# Altium schematic sheet pico_host_board_top.SchDoc
size B; SheetNumber: 1; SheetTotal: 2
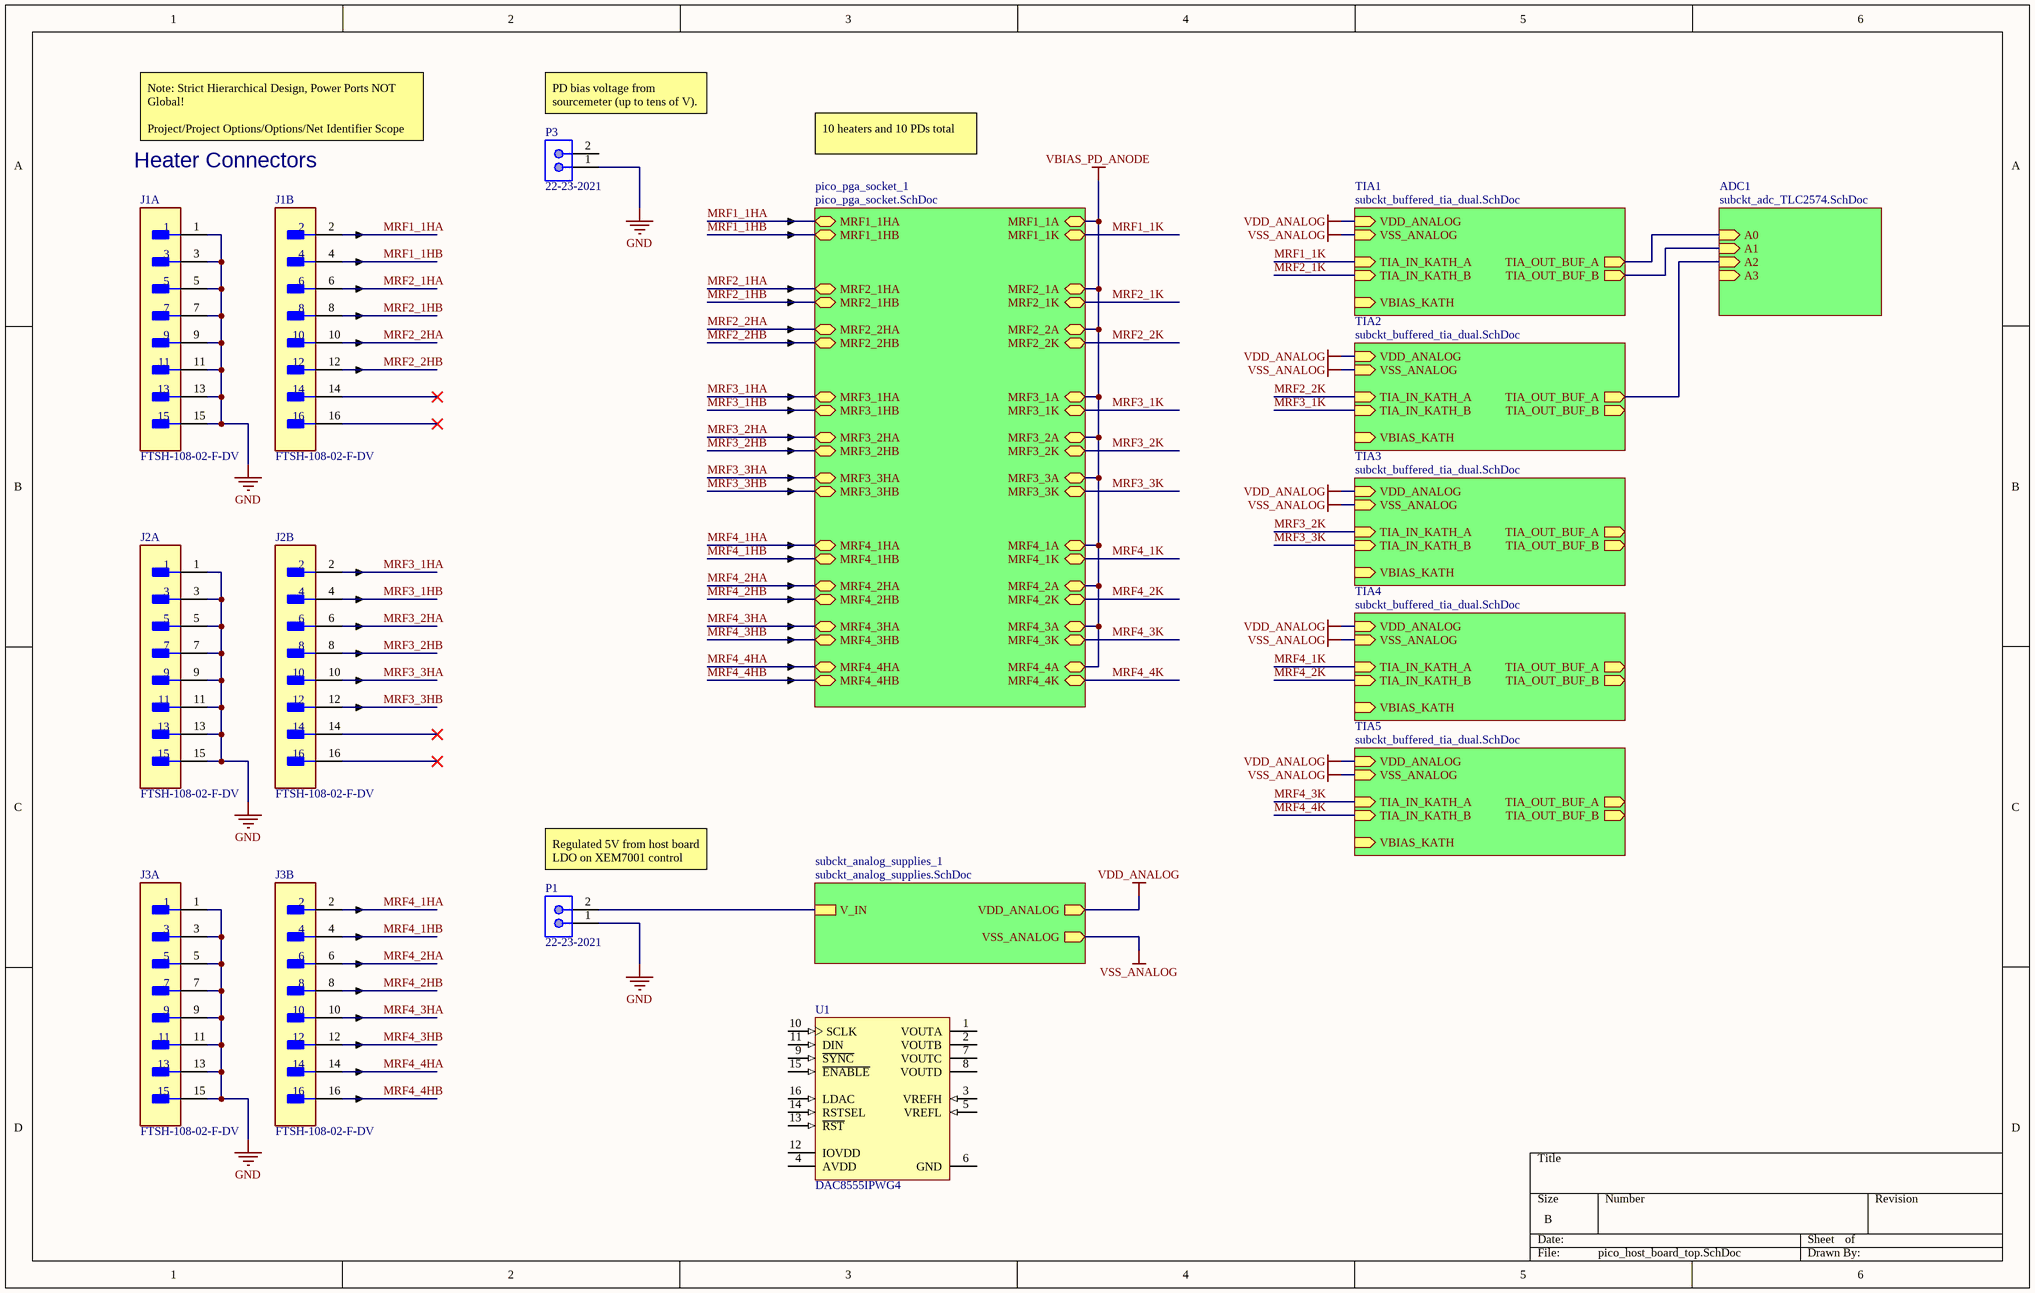
[diagram p0: pico_host_board_top.SchDoc]

## Parts
J1  FTSH-108-02-F-DV  [LIBRARYSOURCE=Vault|VAULTGUID=B7D15EC3-160A-466F-A46C-7801FE6295A7|REVISIONGUID=4386816A-B426-492F-A73C-09950B70C106|FOOTPRINT=FP-FTSH-108-02-F-DV]  (parts A,B of 2)
J2  FTSH-108-02-F-DV  [LIBRARYSOURCE=Vault|VAULTGUID=B7D15EC3-160A-466F-A46C-7801FE6295A7|REVISIONGUID=4386816A-B426-492F-A73C-09950B70C106|FOOTPRINT=FP-FTSH-108-02-F-DV]  (parts A,B of 2)
J3  FTSH-108-02-F-DV  [LIBRARYSOURCE=Vault|VAULTGUID=B7D15EC3-160A-466F-A46C-7801FE6295A7|REVISIONGUID=4386816A-B426-492F-A73C-09950B70C106|FOOTPRINT=FP-FTSH-108-02-F-DV]  (parts A,B of 2)
P1  22-23-2021  [MOLX-22-23-2021_V]
P3  22-23-2021  [MOLX-22-23-2021_V]
U1  DAC8555IPWG4  [TI-PW16_L]

## Sub-sheets
ADC1 = subckt_adc_TLC2574.SchDoc: A0 (in), A1 (in), A2 (in), A3 (in)
pico_pga_socket_1 = pico_pga_socket.SchDoc: MRF1_1HA (bidir), MRF1_1HB (bidir), MRF2_1HA (bidir), MRF2_1HB (bidir), MRF2_2HA (bidir), MRF2_2HB (bidir), MRF3_1HA (bidir), MRF3_1HB (bidir), MRF3_2HA (bidir), MRF3_2HB (bidir), MRF3_3HA (bidir), MRF3_3HB (bidir), MRF4_1HA (bidir), MRF4_1HB (bidir), MRF4_2HA (bidir), MRF4_2HB (bidir), MRF4_3HA (bidir), MRF4_3HB (bidir), MRF4_4HA (bidir), MRF4_4HB (bidir), MRF1_1A (bidir), MRF1_1K (bidir), MRF2_1A (bidir), MRF2_1K (bidir), MRF2_2A (bidir), MRF2_2K (bidir), MRF3_1A (bidir), MRF3_1K (bidir), MRF3_2A (bidir), MRF3_2K (bidir), MRF3_3A (bidir), MRF3_3K (bidir), MRF4_1A (bidir), MRF4_1K (bidir), MRF4_2A (bidir), MRF4_2K (bidir), MRF4_3A (bidir), MRF4_3K (bidir), MRF4_4A (bidir), MRF4_4K (bidir)
subckt_analog_supplies_1 = subckt_analog_supplies.SchDoc: V_IN, VDD_ANALOG (out), VSS_ANALOG (out)
TIA1 = subckt_buffered_tia_dual.SchDoc: VDD_ANALOG (in), VSS_ANALOG (in), TIA_IN_KATH_A (in), VBIAS_KATH (in), TIA_OUT_BUF_A (out), TIA_IN_KATH_B (in), TIA_OUT_BUF_B (out)
TIA2 = subckt_buffered_tia_dual.SchDoc: VDD_ANALOG (in), VSS_ANALOG (in), TIA_IN_KATH_A (in), VBIAS_KATH (in), TIA_OUT_BUF_A (out), TIA_IN_KATH_B (in), TIA_OUT_BUF_B (out)
TIA3 = subckt_buffered_tia_dual.SchDoc: VDD_ANALOG (in), VSS_ANALOG (in), TIA_IN_KATH_A (in), VBIAS_KATH (in), TIA_OUT_BUF_A (out), TIA_IN_KATH_B (in), TIA_OUT_BUF_B (out)
TIA4 = subckt_buffered_tia_dual.SchDoc: VDD_ANALOG (in), VSS_ANALOG (in), TIA_IN_KATH_A (in), VBIAS_KATH (in), TIA_OUT_BUF_A (out), TIA_IN_KATH_B (in), TIA_OUT_BUF_B (out)
TIA5 = subckt_buffered_tia_dual.SchDoc: VDD_ANALOG (in), VSS_ANALOG (in), TIA_IN_KATH_A (in), VBIAS_KATH (in), TIA_OUT_BUF_A (out), TIA_IN_KATH_B (in), TIA_OUT_BUF_B (out)

## Nets
GND: J1.1 J1.3 J1.5 J1.7 J1.9 J1.11 J1.13 J1.15 J2.1 J2.3 J2.5 J2.7 J2.9 J2.11 J2.13 J2.15 J3.1 J3.3 J3.5 J3.7 J3.9 J3.11 J3.13 J3.15 P1.1 P3.1
VBIAS_PD_ANODE: sheet pico_pga_socket_1/MRF1_1A, sheet pico_pga_socket_1/MRF2_1A, sheet pico_pga_socket_1/MRF2_2A, sheet pico_pga_socket_1/MRF3_1A, sheet pico_pga_socket_1/MRF3_2A, sheet pico_pga_socket_1/MRF3_3A, sheet pico_pga_socket_1/MRF4_1A, sheet pico_pga_socket_1/MRF4_2A, sheet pico_pga_socket_1/MRF4_3A, sheet pico_pga_socket_1/MRF4_4A
VDD_ANALOG: sheet subckt_analog_supplies_1/VDD_ANALOG, sheet TIA1/VDD_ANALOG, sheet TIA2/VDD_ANALOG, sheet TIA3/VDD_ANALOG, sheet TIA4/VDD_ANALOG, sheet TIA5/VDD_ANALOG
VSS_ANALOG: sheet subckt_analog_supplies_1/VSS_ANALOG, sheet TIA1/VSS_ANALOG, sheet TIA2/VSS_ANALOG, sheet TIA3/VSS_ANALOG, sheet TIA4/VSS_ANALOG, sheet TIA5/VSS_ANALOG
MRF1_1HA: J1.2 ; sheet pico_pga_socket_1/MRF1_1HA
MRF1_1HB: J1.4 ; sheet pico_pga_socket_1/MRF1_1HB
MRF1_1K: sheet pico_pga_socket_1/MRF1_1K, sheet TIA1/TIA_IN_KATH_A
MRF2_1HA: J1.6 ; sheet pico_pga_socket_1/MRF2_1HA
MRF2_1HB: J1.8 ; sheet pico_pga_socket_1/MRF2_1HB
MRF2_1K: sheet pico_pga_socket_1/MRF2_1K, sheet TIA1/TIA_IN_KATH_B
MRF2_2HA: J1.10 ; sheet pico_pga_socket_1/MRF2_2HA
MRF2_2HB: J1.12 ; sheet pico_pga_socket_1/MRF2_2HB
MRF2_2K: sheet pico_pga_socket_1/MRF2_2K, sheet TIA2/TIA_IN_KATH_A
MRF3_1HA: J2.2 ; sheet pico_pga_socket_1/MRF3_1HA
MRF3_1HB: J2.4 ; sheet pico_pga_socket_1/MRF3_1HB
MRF3_1K: sheet pico_pga_socket_1/MRF3_1K, sheet TIA2/TIA_IN_KATH_B
MRF3_2HA: J2.6 ; sheet pico_pga_socket_1/MRF3_2HA
MRF3_2HB: J2.8 ; sheet pico_pga_socket_1/MRF3_2HB
MRF3_2K: sheet pico_pga_socket_1/MRF3_2K, sheet TIA3/TIA_IN_KATH_A
MRF3_3HA: J2.10 ; sheet pico_pga_socket_1/MRF3_3HA
MRF3_3HB: J2.12 ; sheet pico_pga_socket_1/MRF3_3HB
MRF3_3K: sheet pico_pga_socket_1/MRF3_3K, sheet TIA3/TIA_IN_KATH_B
MRF4_1HA: J3.2 ; sheet pico_pga_socket_1/MRF4_1HA
MRF4_1HB: J3.4 ; sheet pico_pga_socket_1/MRF4_1HB
MRF4_1K: sheet pico_pga_socket_1/MRF4_1K, sheet TIA4/TIA_IN_KATH_A
MRF4_2HA: J3.6 ; sheet pico_pga_socket_1/MRF4_2HA
MRF4_2HB: J3.8 ; sheet pico_pga_socket_1/MRF4_2HB
MRF4_2K: sheet pico_pga_socket_1/MRF4_2K, sheet TIA4/TIA_IN_KATH_B
MRF4_3HA: J3.10 ; sheet pico_pga_socket_1/MRF4_3HA
MRF4_3HB: J3.12 ; sheet pico_pga_socket_1/MRF4_3HB
MRF4_3K: sheet pico_pga_socket_1/MRF4_3K, sheet TIA5/TIA_IN_KATH_A
MRF4_4HA: J3.14 ; sheet pico_pga_socket_1/MRF4_4HA
MRF4_4HB: J3.16 ; sheet pico_pga_socket_1/MRF4_4HB
MRF4_4K: sheet pico_pga_socket_1/MRF4_4K, sheet TIA5/TIA_IN_KATH_B
NetP1_2: P1.2 ; sheet subckt_analog_supplies_1/V_IN
(unnamed): sheet TIA1/TIA_OUT_BUF_A, sheet ADC1/A0
(unnamed): sheet TIA1/TIA_OUT_BUF_B, sheet ADC1/A1
(unnamed): sheet TIA2/TIA_OUT_BUF_A, sheet ADC1/A2

Not connected (* = marked no-connect by the designer): J1 14* 16*; J2 14* 16*; P3 2; U1 1(VOUTA) 2(VOUTB) 3(VREFH) 4(AVDD) 5(VREFL) 6(GND) 7(VOUTC) 8(VOUTD) 9(~{SYNC}) 10(SCLK) 11(DIN) 12(IOVDD) 13(~{RST}) 14(RSTSEL) 15(~{ENABLE}) 16(LDAC)

## Notes on the sheet
- Note: Strict Hierarchical Design, Power Ports NOT Global!
  Project/Project Options/Options/Net Identifier Scope
- (near P3) PD bias voltage from sourcemeter (up to tens of V).
- 10 heaters and 10 PDs total
- Heater Connectors
- (near P1) Regulated 5V from host board LDO on XEM7001 control board.

## Library data of the parts
J1-J3 = FP-FTSH-108-02-F-DV: CONN HEADER SMD 16POS 1.27MM; Manufacturer: Samtec; Standoff Height: 0.46mm; Conn Orientation: Vertical; Current Rating: 3.4A; Number Of Contacts: 16; Conn Gender: Male; Lead Free: Yes; Package: FTSH-108-02-F-DV; Footprint Url: http://suddendocs.samtec.com/prints/ftsh-1xx-xx-xxx-dv-xxx-footprint.pdf; Automotive: No; Pitch: 1.27mm; Manufacturer Part Number: FTSH-108-02-F-DV; Device Class L2: Headers and Wire Housings; ComponentLink2URL: http://suddendocs.samtec.com/prints/ftsh-1xx-xx-xxx-dv-xxx-xxx-mkt.pdf; ComponentLink2Description: Datasheet; Octopart: https://octopart.com/ftsh-108-02-f-dv-samtec-10605893; RoHS: TRUE; Digikey Description: CONN HEADER SMD 16POS 1.27MM; Device Class L1: Connectors; Temperature Range High: +125°C; Temperature: -55°C to +125°C; Device Class L3: unset; Category: Conn; Temperature Range Low: -55°C; Number Of Rows: 2; Contact Material: Gold,Nickel; Mouser Description: Conn Unshrouded Header HDR 16 POS 1.27mm Solder ST SMD Tube; Height: 5.09mm
P1 P3 = CMP-1704-00001-3: Male Header, Pitch 2.54 mm, 1 x 2 Position, Height 10.67 mm, Tail Length 3.56 mm, 0 to 75 degC, RoHS, Bulk; Package Quantity: 3000; Height: 10.67 mm; RoHSCompliant: True; ComponentLink2URL: https://datasheet.ciiva.com/19454/232266-19454304.pdf; PartNumber: 22-23-2021; Packaging: Bulk; ComponentLink2Description: Datasheet; Min Operating Temperature: 0 degC; ComponentLink1Description: Manufacturer URL; Length: 5.08 mm; Mounting Technology: Through Hole; Max Operating Temperature: 75 degC; REACH SVHC: Unknown; PackageDescription: Male Header, Pitch 2.54 mm, 1 x 2 Position, Height 10.67 mm, Tail Length 3.56 mm; ComponentLink1URL: http://www.molex.com/; Mount: Through Hole; Radiation Hardening: No; Width: 6.35 mm; Pins: 2
U1 = CMP-0004-01174-1: 16-Bit, Quad Channel, Ultralow Glitch, Voltage Output Digital to Analog Converter, -40 to 105 degC, 16-pin SOP (PW16), Green (RoHS & no Sb/Br); Manufacturer: Texas Instruments; SubFamily: Precision DAC (=<10MSPS); Resolution(Bits): 16; SNR(dB): 95; Interface: Serial SPI; SFDR(dB): 87; DAC Channels: 4; Settling Time(us): 10; DNL(Max)(+/-LSB): 1; ComponentLink2Description: Datasheet; PackageReference: PW16; PackageVersion: 4040064-4/G, 02/2011; ComponentLink3Description: Package Specification; Code_JEDEC: MO-153; Eco-Plan: Green (RoHS & no Sb/Br); Mounting Technology: Surface Mount; DatasheetVersion: SLAS475B; PackageDescription: 16-Pin Plastic Small Outline, Body 5 x 4.4 mm, Pitch 0.65 mm; ComponentLink1Description: Manufacturer URL; ComponentLink1URL: http://www.ti.com/; ComponentLink3URL: http://www.ti.com/lit/ml/mpds361/mpds361.pdf; PartNumber: DAC8555IPWG4; ComponentLink2URL: http://www.ti.com/general/docs/lit/getliterature.tsp?genericPartNumber=DAC8555&fileType=pdf